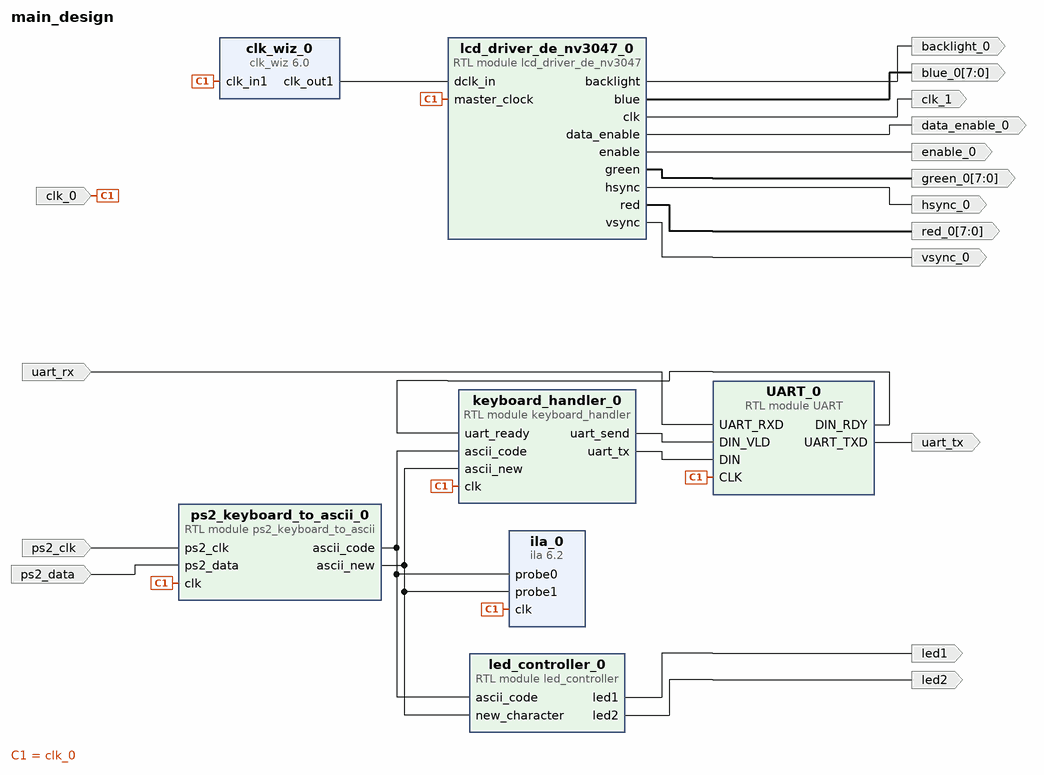
[diagram p0: block diagram of the top level]
# Vivado block design main_design, xc7a100tfgg676-1, Vivado 2025.1
create_bd_design main_design

create_bd_port -dir I -type clk clk_0
set_property -dict {CONFIG.FREQ_HZ 50000000} [get_bd_ports clk_0]
create_bd_port -dir O -type data led1
create_bd_port -dir O led2
create_bd_port -dir I -type data ps2_data
create_bd_port -dir I -type clk ps2_clk
set_property -dict {CONFIG.CLK_DOMAIN main_design_ps2_clk_0 CONFIG.FREQ_HZ 100000000} [get_bd_ports ps2_clk]
create_bd_port -dir I -type data uart_rx
create_bd_port -dir O -type data uart_tx
create_bd_port -dir O -from 7 -to 0 red_0
create_bd_port -dir O -from 7 -to 0 green_0
create_bd_port -dir O -from 7 -to 0 blue_0
create_bd_port -dir O enable_0
create_bd_port -dir O -type clk clk_1
create_bd_port -dir O hsync_0
create_bd_port -dir O vsync_0
create_bd_port -dir O data_enable_0
create_bd_port -dir O backlight_0

create_bd_cell -type module -reference ps2_keyboard_to_ascii ps2_keyboard_to_ascii_0
create_bd_cell -type ip -vlnv xilinx.com:ip:ila:6.2 ila_0
set_property -dict [list \
  CONFIG.C_MONITOR_TYPE Native \
  CONFIG.C_NUM_OF_PROBES 2 \
  CONFIG.C_PROBE0_WIDTH 7 \
  CONFIG.C_PROBE2_WIDTH 1 \
] [get_bd_cells ila_0]
create_bd_cell -type module -reference led_controller led_controller_0
create_bd_cell -type module -reference UART UART_0
create_bd_cell -type module -reference keyboard_handler keyboard_handler_0
create_bd_cell -type module -reference lcd_driver_de_nv3047 lcd_driver_de_nv3047_0
create_bd_cell -type ip -vlnv xilinx.com:ip:clk_wiz:6.0 clk_wiz_0
set_property -dict [list \
  CONFIG.CLKIN1_JITTER_PS 200.0 \
  CONFIG.CLKOUT1_DRIVES BUFG \
  CONFIG.CLKOUT1_JITTER 302.798 \
  CONFIG.CLKOUT1_PHASE_ERROR 161.614 \
  CONFIG.CLKOUT1_REQUESTED_OUT_FREQ 9 \
  CONFIG.CLKOUT2_DRIVES BUFG \
  CONFIG.CLKOUT3_DRIVES BUFG \
  CONFIG.CLKOUT4_DRIVES BUFG \
  CONFIG.CLKOUT5_DRIVES BUFG \
  CONFIG.CLKOUT6_DRIVES BUFG \
  CONFIG.CLKOUT7_DRIVES BUFG \
  CONFIG.MMCM_BANDWIDTH OPTIMIZED \
  CONFIG.MMCM_CLKFBOUT_MULT_F 18 \
  CONFIG.MMCM_CLKIN1_PERIOD 20.000 \
  CONFIG.MMCM_CLKIN2_PERIOD 10.0 \
  CONFIG.MMCM_CLKOUT0_DIVIDE_F 100 \
  CONFIG.MMCM_COMPENSATION ZHOLD \
  CONFIG.PLL_CLKIN_PERIOD 20.000 \
  CONFIG.PRIMITIVE PLL \
  CONFIG.PRIM_IN_FREQ 50 \
  CONFIG.PRIM_SOURCE No_buffer \
  CONFIG.USE_LOCKED false \
  CONFIG.USE_RESET false \
] [get_bd_cells clk_wiz_0]

# ---- connections ----

connect_bd_net [get_bd_pins UART_0/DIN_RDY] [get_bd_pins keyboard_handler_0/uart_ready]
connect_bd_net [get_bd_pins UART_0/UART_TXD] [get_bd_ports uart_tx]
connect_bd_net -net clk_0_1 [get_bd_ports clk_0] \
  [get_bd_pins ps2_keyboard_to_ascii_0/clk] [get_bd_pins ila_0/clk] [get_bd_pins UART_0/CLK] \
  [get_bd_pins keyboard_handler_0/clk] [get_bd_pins clk_wiz_0/clk_in1] [get_bd_pins lcd_driver_de_nv3047_0/master_clock]
connect_bd_net [get_bd_pins clk_wiz_0/clk_out1] [get_bd_pins lcd_driver_de_nv3047_0/dclk_in]
connect_bd_net [get_bd_pins keyboard_handler_0/uart_send] [get_bd_pins UART_0/DIN_VLD]
connect_bd_net [get_bd_pins keyboard_handler_0/uart_tx] [get_bd_pins UART_0/DIN]
connect_bd_net [get_bd_pins lcd_driver_de_nv3047_0/backlight] [get_bd_ports backlight_0]
connect_bd_net [get_bd_pins lcd_driver_de_nv3047_0/blue] [get_bd_ports blue_0]
connect_bd_net [get_bd_pins lcd_driver_de_nv3047_0/clk] [get_bd_ports clk_1]
connect_bd_net [get_bd_pins lcd_driver_de_nv3047_0/data_enable] [get_bd_ports data_enable_0]
connect_bd_net [get_bd_pins lcd_driver_de_nv3047_0/enable] [get_bd_ports enable_0]
connect_bd_net [get_bd_pins lcd_driver_de_nv3047_0/green] [get_bd_ports green_0]
connect_bd_net [get_bd_pins lcd_driver_de_nv3047_0/hsync] [get_bd_ports hsync_0]
connect_bd_net [get_bd_pins lcd_driver_de_nv3047_0/red] [get_bd_ports red_0]
connect_bd_net [get_bd_pins lcd_driver_de_nv3047_0/vsync] [get_bd_ports vsync_0]
connect_bd_net [get_bd_pins led_controller_0/led1] [get_bd_ports led1]
connect_bd_net [get_bd_pins led_controller_0/led2] [get_bd_ports led2]
connect_bd_net [get_bd_ports ps2_clk] [get_bd_pins ps2_keyboard_to_ascii_0/ps2_clk]
connect_bd_net [get_bd_ports ps2_data] [get_bd_pins ps2_keyboard_to_ascii_0/ps2_data]
connect_bd_net [get_bd_pins ps2_keyboard_to_ascii_0/ascii_code] \
  [get_bd_pins ila_0/probe0] [get_bd_pins led_controller_0/ascii_code] [get_bd_pins keyboard_handler_0/ascii_code]
connect_bd_net [get_bd_pins ps2_keyboard_to_ascii_0/ascii_new] \
  [get_bd_pins ila_0/probe1] [get_bd_pins led_controller_0/new_character] [get_bd_pins keyboard_handler_0/ascii_new]
connect_bd_net [get_bd_ports uart_rx] [get_bd_pins UART_0/UART_RXD]

validate_bd_design
save_bd_design
